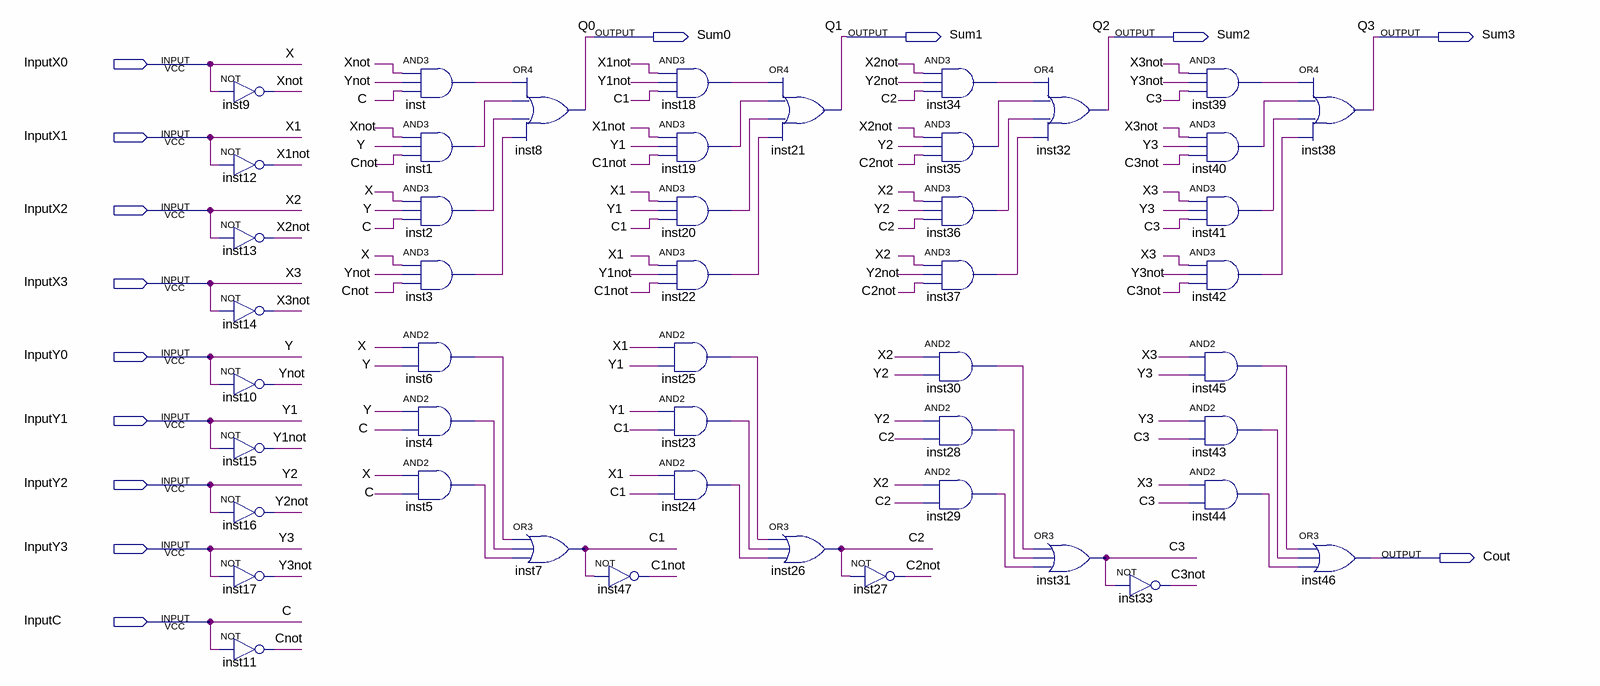
[diagram p0: schematic sheet]
// Quartus schematic Lab3Adder.bdf as structural Verilog: 48 symbols, 14 pins
module Lab3Adder (
  input  InputX0,
  input  InputX1,
  input  InputX2,
  input  InputX3,
  input  InputY0,
  input  InputY1,
  input  InputY2,
  input  InputY3,
  input  InputC,
  output Sum0,
  output Sum1,
  output Sum2,
  output Sum3,
  output Cout
);

  wire C1, C1not, C2, C2not, C3, C3not, Cnot, inst1_out, inst2_out, inst3_out, inst4_out, inst5_out,
       inst6_out, inst18_out, inst19_out, inst20_out, inst22_out, inst23_out, inst24_out, inst25_out,
       inst28_out, inst29_out, inst30_out, inst34_out, inst35_out, inst36_out, inst37_out, inst39_out,
       inst40_out, inst41_out, inst42_out, inst43_out, inst44_out, inst45_out, inst_out, X1not, X2not, X3not,
       Xnot, Y1not, Y2not, Y3not, Ynot;

  not inst9 (Xnot, InputX0);
  not inst12 (X1not, InputX1);
  not inst13 (X2not, InputX2);
  not inst14 (X3not, InputX3);
  not inst10 (Ynot, InputY0);
  not inst15 (Y1not, InputY1);
  not inst16 (Y2not, InputY2);
  not inst17 (Y3not, InputY3);
  not inst11 (Cnot, InputC);
  and inst (inst_out, Xnot, Ynot, InputC);
  and inst1 (inst1_out, Xnot, InputY0, Cnot);
  and inst2 (inst2_out, InputX0, InputY0, InputC);
  and inst3 (inst3_out, InputX0, Ynot, Cnot);
  and inst6 (inst6_out, InputX0, InputY0);
  and inst4 (inst4_out, InputY0, InputC);
  and inst5 (inst5_out, InputX0, InputC);
  or inst8 (Sum0, inst_out, inst1_out, inst2_out, inst3_out);
  or inst7 (C1, inst6_out, inst4_out, inst5_out);
  and inst18 (inst18_out, X1not, Y1not, C1);
  and inst19 (inst19_out, X1not, InputY1, C1not);
  and inst20 (inst20_out, InputX1, InputY1, C1);
  and inst22 (inst22_out, InputX1, Y1not, C1not);
  and inst25 (inst25_out, InputX1, InputY1);
  and inst23 (inst23_out, InputY1, C1);
  and inst24 (inst24_out, InputX1, C1);
  not inst47 (C1not, C1);
  or inst21 (Sum1, inst18_out, inst19_out, inst20_out, inst22_out);
  or inst26 (C2, inst25_out, inst23_out, inst24_out);
  not inst27 (C2not, C2);
  and inst34 (inst34_out, X2not, Y2not, C2);
  and inst35 (inst35_out, X2not, InputY2, C2not);
  and inst36 (inst36_out, InputX2, InputY2, C2);
  and inst37 (inst37_out, InputX2, Y2not, C2not);
  and inst30 (inst30_out, InputX2, InputY2);
  and inst28 (inst28_out, InputY2, C2);
  and inst29 (inst29_out, InputX2, C2);
  or inst32 (Sum2, inst34_out, inst35_out, inst36_out, inst37_out);
  or inst31 (C3, inst30_out, inst28_out, inst29_out);
  not inst33 (C3not, C3);
  and inst39 (inst39_out, X3not, Y3not, C3);
  and inst40 (inst40_out, X3not, InputY3, C3not);
  and inst41 (inst41_out, InputX3, InputY3, C3);
  and inst42 (inst42_out, InputX3, Y3not, C3not);
  and inst45 (inst45_out, InputX3, InputY3);
  and inst43 (inst43_out, InputY3, C3);
  and inst44 (inst44_out, InputX3, C3);
  or inst38 (Sum3, inst39_out, inst40_out, inst41_out, inst42_out);
  or inst46 (Cout, inst45_out, inst43_out, inst44_out);

  // Other names for the same wires on the sheet: C = InputC; Y = InputY0; Y1 = InputY1; Y2 = InputY2; Y3 = InputY3;
  //   Q0 = Sum0; Q1 = Sum1; Q2 = Sum2; Q3 = Sum3; X = InputX0; X1 = InputX1; X2 = InputX2; X3 = InputX3
endmodule
